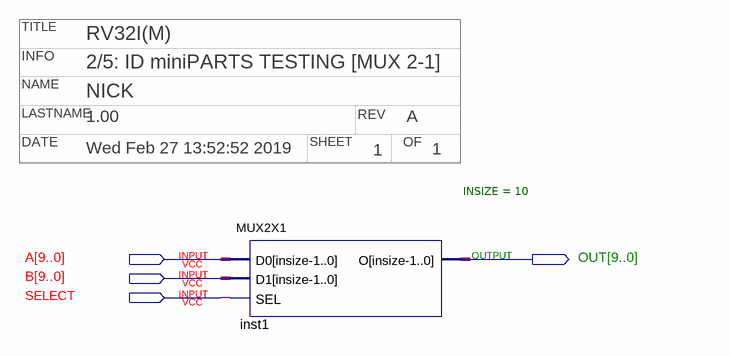
[diagram p0: schematic sheet]
// Quartus schematic MUX2X1TEST.bdf as structural Verilog: 1 symbols, 4 pins
// Title block: TITLE: RV32I(M); INFO: 2/5: ID miniPARTS TESTING [MUX 2-1]; NAME: NICK; LASTNAME: 1.00; REV: A; DATE: Wed Feb 27 13:52:52 2019; SHEET: 1; OF: 1
module MUX2X1TEST (
  input  [9:0] A,
  input  [9:0] B,
  input  SELECT,
  output [9:0] OUT
);

  MUX2X1 #(.INSIZE(10)) inst1 (.D0(A), .D1(B), .SEL(SELECT), .O(OUT));
endmodule
